# EAGLE design PROG328P (EAGLE 8.0.1)
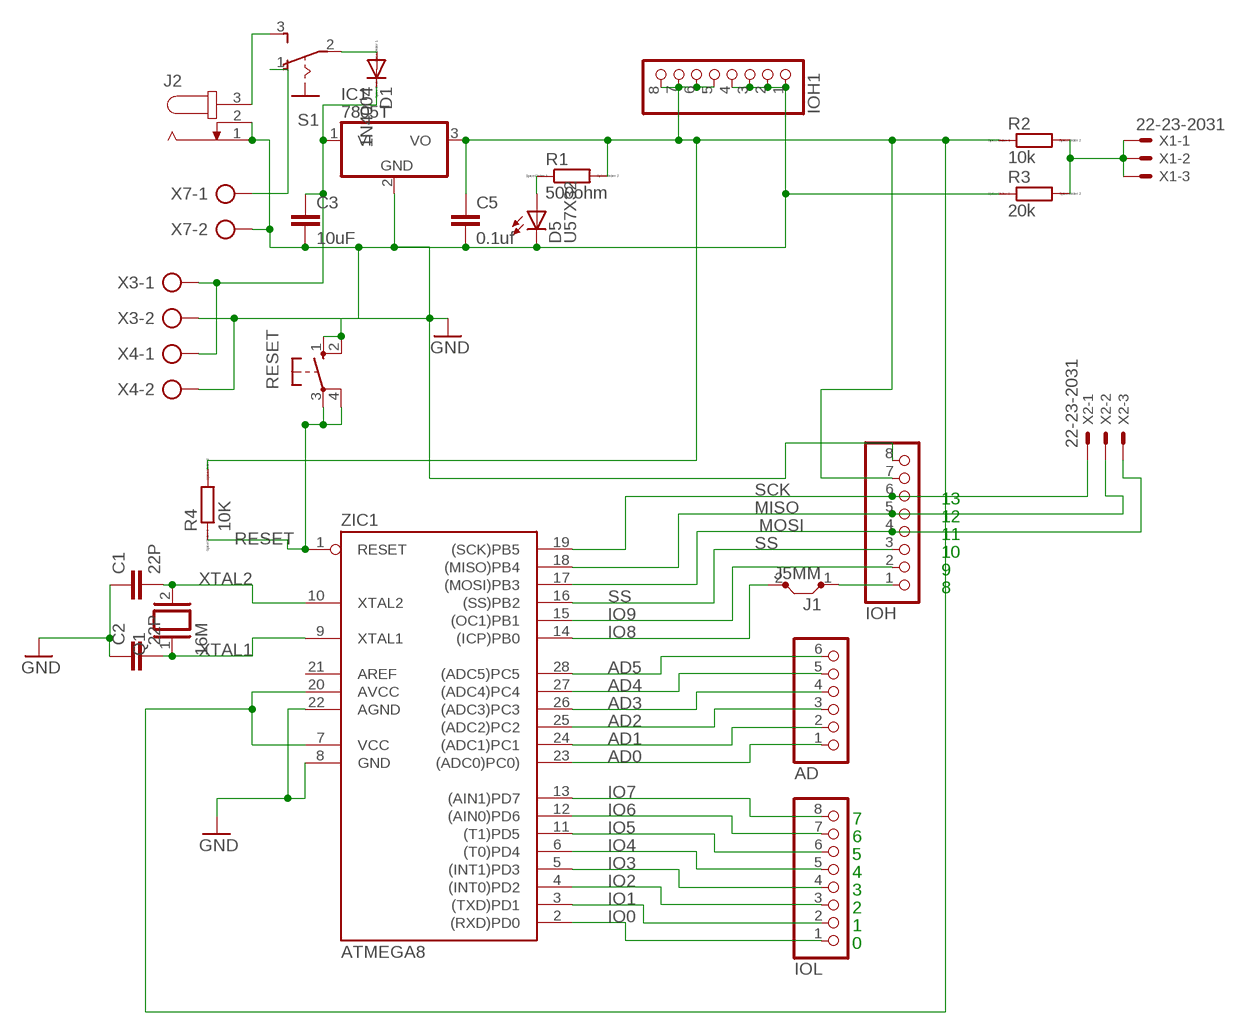
[diagram p0: schematic, sheet 1]

## Parts
AD  PINHD-1X6  [1X06]
C1  22P  C2.5/6  [C2.5-6]
C2  22P  C2.5/6  [C2.5-6]
C3  10uF  C2.5/4  [C2.5-4]
C5  0.1uf  C2.5/4  [C2.5-4]
D1  1N4004  [DO41-10]
D5  U57X32  [U57X32]
IC1  7805T  [TO220H]
IOH  PINHD-1X8  [1X08]
IOH1  PINHD-1X8  [1X08]
IOL  PINHD-1X8  [1X08]
J1  J5MM  [05]
J2  JACK-PLUG0  [SPC4077]
Q1  16M  XTAL/S  [QS]
R1  500ohm  R0207/10  [0207/10]
R2  10k  R0207/10  [0207/10]
R3  20k  R0207/10  [0207/10]
R4  10K  R0207/10  [0207/10]
RESET  10-XX  [B3F-10XX]
S1  255SB  [255SB]
X1  22-23-2031  [22-23-2031]
X2  22-23-2031  [22-23-2031]
X3  AK500/2-H  [AK500/2-H]
X4  AK500/2-H  [AK500/2-H]
X7  AK500/2-H  [AK500/2-H]
ZIC1  ATMEGA8  AT90S4433P  [DIL28-3]

## Nets
AD0: AD.1 ZIC1.23((ADC0)PC0))
AD1: AD.2 ZIC1.24((ADC1)PC1)
AD2: AD.3 ZIC1.25((ADC2)PC2)
AD3: AD.4 ZIC1.26((ADC3)PC3)
AD4: AD.5 ZIC1.27((ADC4)PC4)
AD5: AD.6 ZIC1.28((ADC5)PC5)
GND: C1.1 C2.1 C3.2 C5.2 D5.K(C) IC1.2(GND) IOH1.1 IOH1.2 IOH1.3 IOH1.4 IOH.8 J2.1 J2.2 R3.1 RESET.1(S) RESET.2(S1) X3.2 X4.2 X7.2 ZIC1.8(GND) ZIC1.22(AGND)
IO0: IOL.1 ZIC1.2((RXD)PD0)
IO1: IOL.2 ZIC1.3((TXD)PD1)
IO2: IOL.3 ZIC1.4((INT0)PD2)
IO3: IOL.4 ZIC1.5((INT1)PD3)
IO4: IOL.5 ZIC1.6((T0)PD4)
IO5: IOL.6 ZIC1.11((T1)PD5)
IO6: IOL.7 ZIC1.12((AIN0)PD6)
IO7: IOL.8 ZIC1.13((AIN1)PD7)
IO8: J1.2 ZIC1.14((ICP)PB0)
IO9: IOH.2 ZIC1.15((OC1)PB1)
MISO: IOH.5 X2.2 ZIC1.18((MISO)PB4)
MOSI: IOH.4 X2.3 ZIC1.17((MOSI)PB3)
N$1: IOH.1 J1.1
N$2: D5.A R1.1
N$3: J2.3 S1.3(S)
N$4: S1.1(O) X7.1
N$5: R2.2 R3.2 X1.1 X1.2 X1.3
N$6: D1.A S1.2(P)
N$15: C3.1 D1.C IC1.1(VI) X3.1 X4.1
RESET: R4.1 RESET.3(P) RESET.4(P1) ZIC1.1(RESET)
SCK: IOH.6 X2.1 ZIC1.19((SCK)PB5)
SS: IOH.3 ZIC1.16((SS)PB2)
VCC: C5.1 IC1.3(VO) IOH1.5 IOH1.6 IOH1.7 IOH1.8 IOH.7 R1.2 R2.1 R4.2 ZIC1.7(VCC) ZIC1.20(AVCC)
XTAL1: C2.2 Q1.1 ZIC1.9(XTAL1)
XTAL2: C1.2 Q1.2 ZIC1.10(XTAL2)
Unconnected: ZIC1.21(AREF)

## Notes on the sheet
- 13
- 12
- 11
- 10
- 9
- 8
- 7
- 6
- 5
- 4
- 3
- 2
- 1
- 0

## Library data of the parts
AD = pinhead:PINHD-1X6: PIN HEADER
C1-C3 C5 = capacitor-wima:C: CAPACITOR naming: grid - package width
D1 = diode:1N4004: DIODE general purpose rectifier, 1 A
D5 = led:U57X32: LED rectangle, 5.7 x 3.2 mm
IC1 = linear:78*: Positive VOLTAGE REGULATOR Source: http://cache.national.com/ds/LM/LM78L05.pdf http://www.fairchildsemi.com/ds/LM/LM7805.pdf
IOH IOH1 IOL = pinhead:PINHD-1X8: PIN HEADER
J1 = jumper:J: Bridge
J2 = con-jack:JACK-PLUG: DC POWER JACK Power Jack, DC, Right Angle, Through Hole, Rated 5A at 16VDC, PC Terminals Distributor: Farnell (www.Farnell.de) Drawing: 84N1161.pdf / 84N1162.pdf Manufacturer: SPC Technology (www.spctechnology.com) Type: SPC4077 / SPC 4078; OC_FARNELL: unknown; OC_NEWARK: unknown
Q1 = special:XTAL/S: CRYSTAL
R1-R4 = eagle-ltspice:R: RESISTOR, European symbol; SPICEMODEL: NONE; SPICEPREFIX: R
RESET = switch-omron:10-XX: OMRON SWITCH; MPN: B3F-1000; OC_FARNELL: 176432; OC_NEWARK: 36M3542
S1 = switch:255SB: SLIDING SWITCH Distributor Buerklin, 11G810
X1 X2 = con-molex:22-23-2031: .100" (2.54mm) Center Header - 3 Pin; MF: MOLEX; MPN: 22-23-2031; OC_FARNELL: 1462950; OC_NEWARK: 30C0862
X3 X4 X7 = con-ptr500:AK500/2-H: CONNECTOR Aug. 2004 / PTR Meßtechnik: Die Bezeichnung der Serie AK505 wurde geändert. Es handelt sich hierbei um AK500 in horizontaler Ausführung.; OC_FARNELL: unknown; OC_NEWARK: unknown
ZIC1 = atmel:AT90S4433: MICROCONTROLLER 4 Kbytes FLASH 128 bytes SRAM 256 bytes EEPROM UART 6-channel 10 bit ADC

## Board
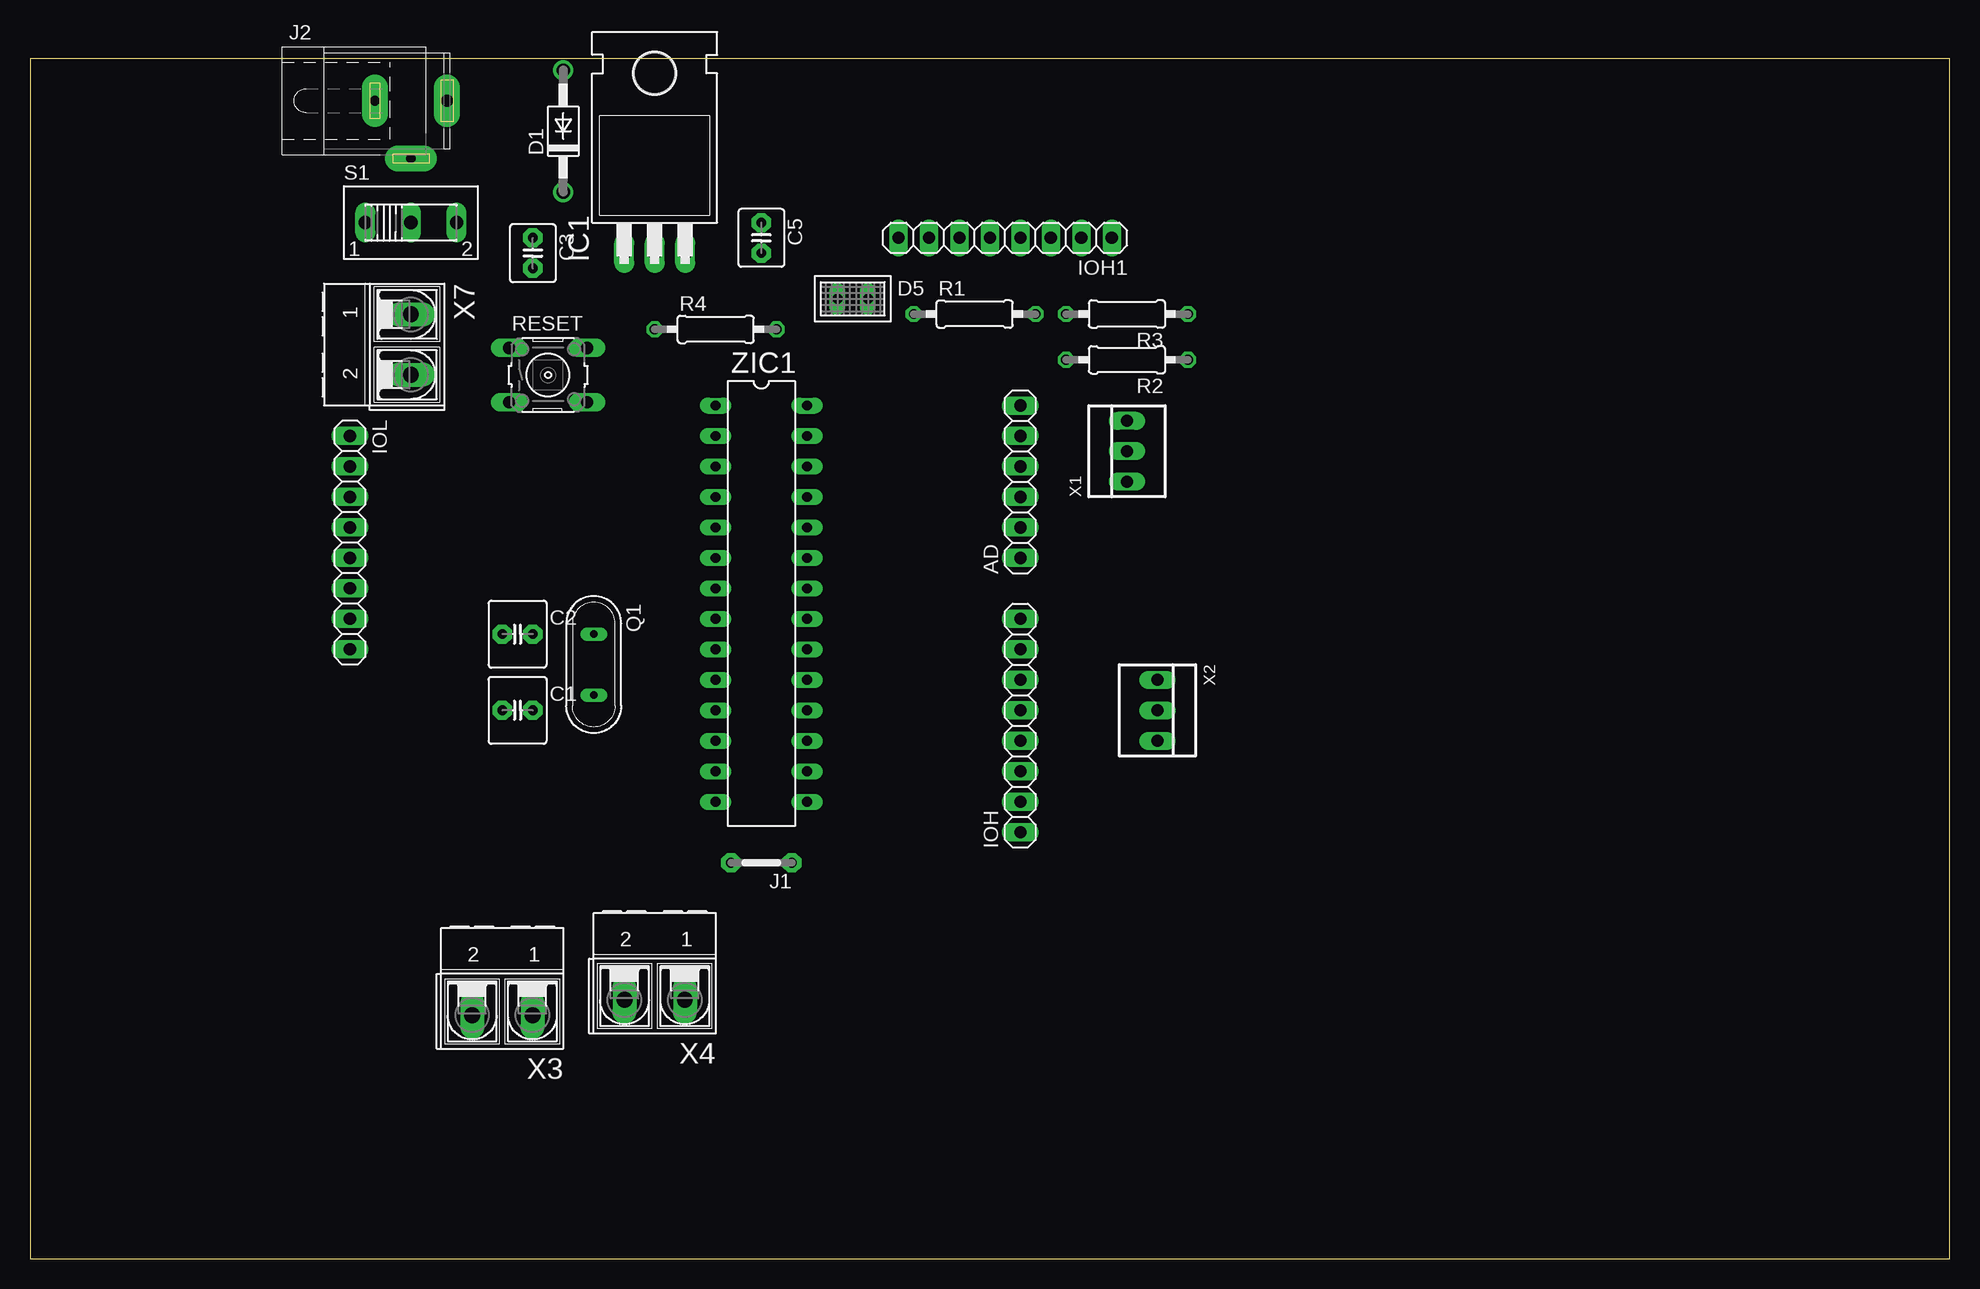
[diagram p1: board, top side]
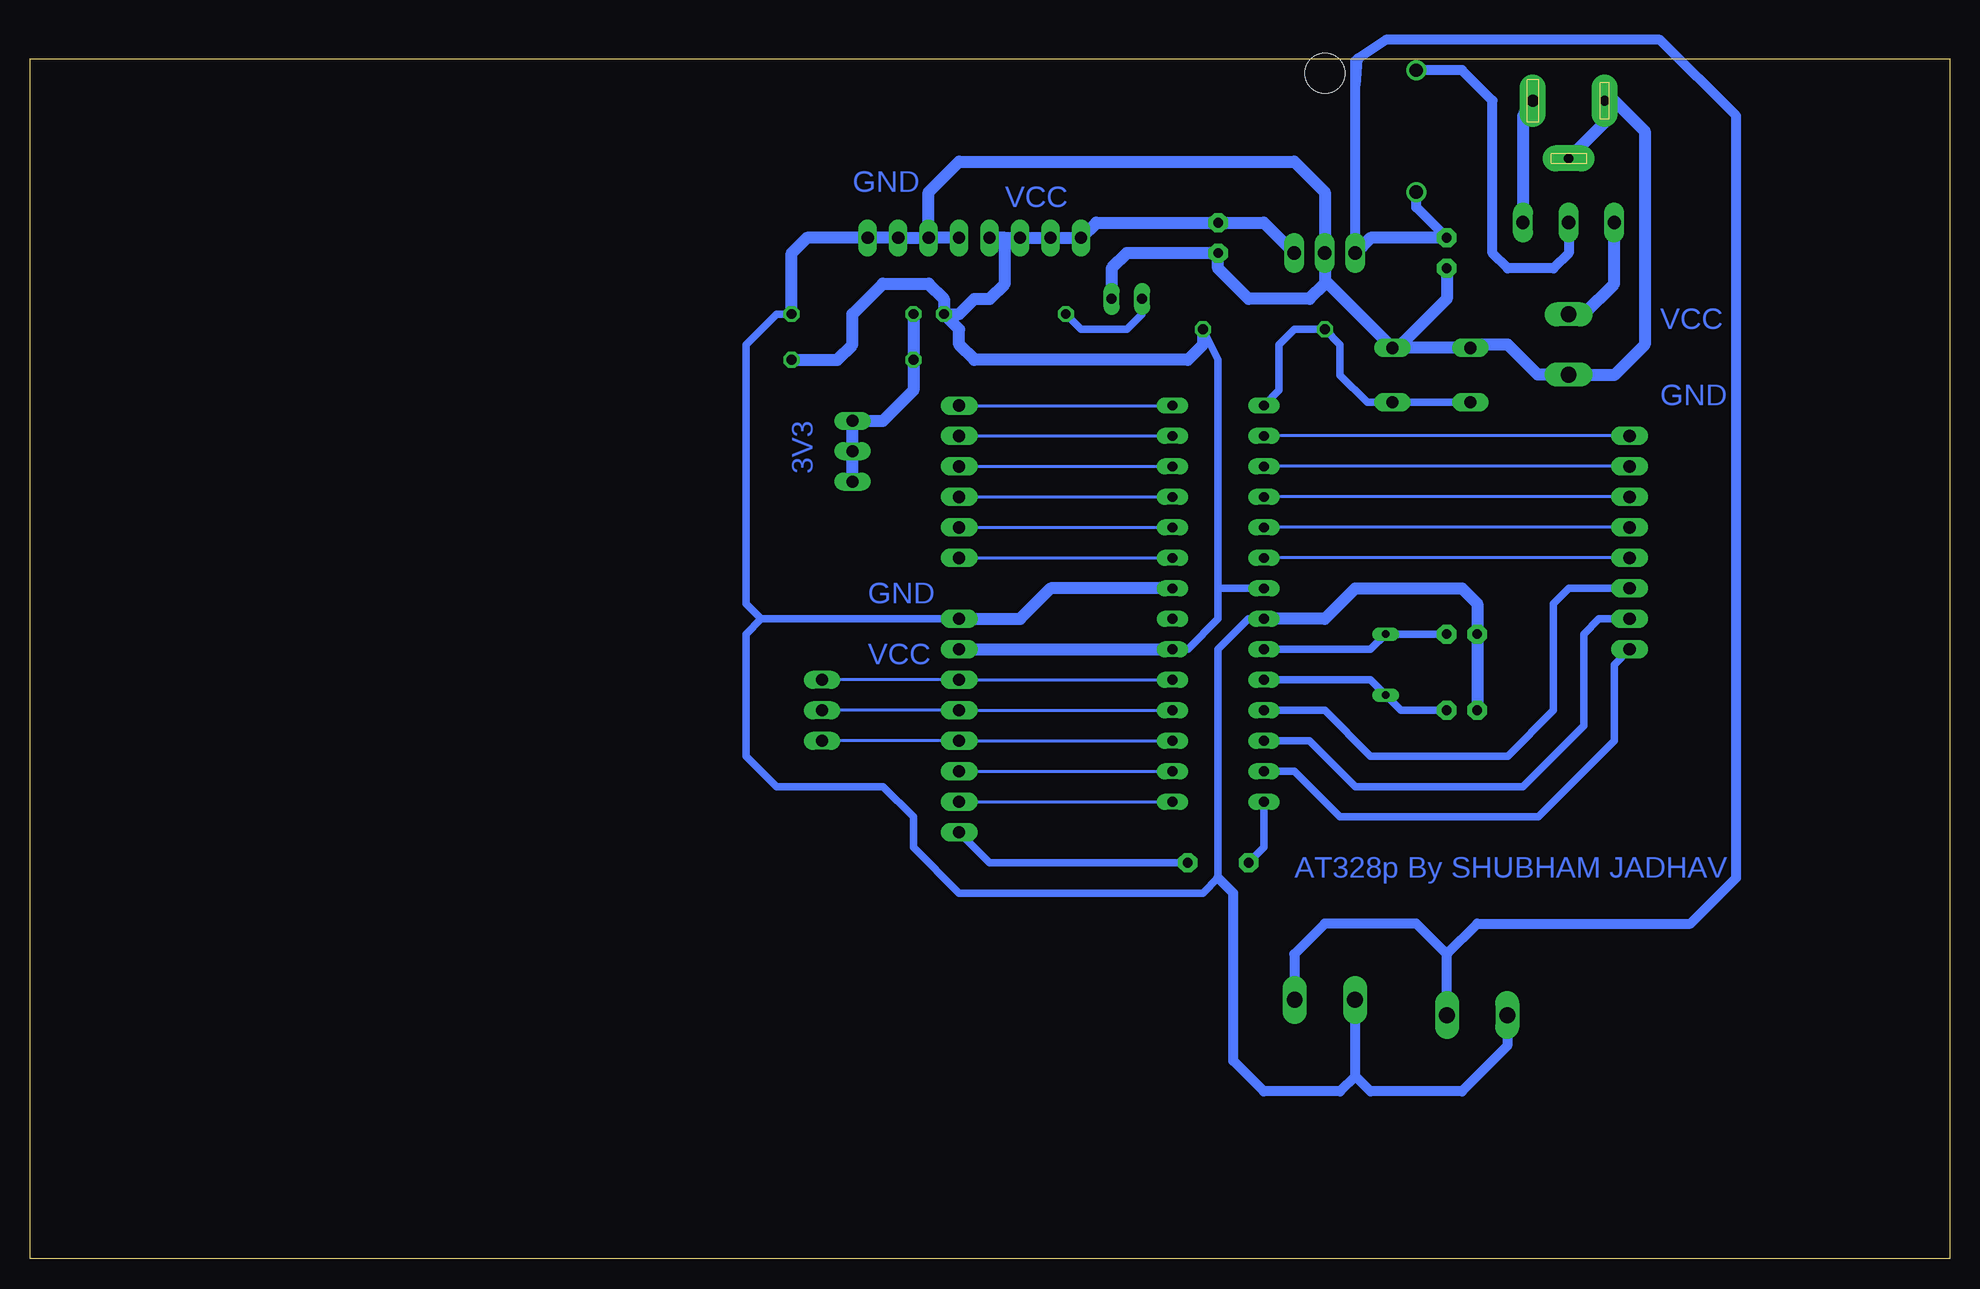
[diagram p2: board, bottom side, seen from below]

Size 160 x 100 mm. Coordinates in mm from the lower left corner, seen from the top.
Outline: 0,0 160,0 160,100 0,100 0,0
Copper layers (1*16): Top 0.035mm / dielectric 1.5mm / Bottom 0.035mm
Design rules "default": minimum track width 10mil, minimum drill 24mil, track to track 8mil, track to pad 8mil, pad to pad 8mil, via to via 8mil, smd to smd 8mil, copper to edge 40mil, drill to drill 8mil, minimum pad ring 10mil, minimum via ring 8mil, stop-mask expansion 4mil, vias tented up to drill 0mil, thermal gap 10mil

### Footprints (pad centres in the part's own frame; a part is rotated, then mirrored left to right if it is on the bottom)
1X06 = drill 1.016 long: 1 -6.35,0; 2 -3.81,0; 3 -1.27,0; 4 1.27,0; 5 3.81,0; 6 6.35,0
C2.5-6 = drill 0.813 pad 1.6 octagon: 1 -1.27,0; 2 1.27,0
C2.5-4 = drill 0.813 pad 1.6 octagon: 1 -1.27,0; 2 1.27,0
DO41-10 = drill 1.118: A 5.08,0; C -5.08,0
U57X32 = drill 0.813 long: A -1.27,0; K 1.27,0
TO220H = drill 1.118 long: 1 -2.54,-10.16; 2 0,-10.16; 3 2.54,-10.16 | hole 3.302: 0,4.826
1X08 = drill 1.016 long: 1 -8.89,0; 2 -6.35,0; 3 -3.81,0; 4 -1.27,0; 5 1.27,0; 6 3.81,0; 7 6.35,0; 8 8.89,0
05 = drill 0.813 pad 1.6 octagon: 1 -2.54,0; 2 2.54,0
SPC4077 = drill 0.8 pad 2.184 long: 1 -3,0; 2 0,-4.8 | drill 1 pad 2.184 long: 3 3,0
QS = drill 0.61 long: 1 -2.54,0; 2 2.54,0
0207/10 = drill 0.813 octagon: 1 -5.08,0; 2 5.08,0
B3F-10XX = drill 1.016 long: 1 -3.251,2.261; 2 3.251,2.261; 3 -3.251,-2.261; 4 3.251,-2.261
255SB = drill 1.118 long: 1 -3.81,0; 2 0,0; 3 3.81,0
22-23-2031 = drill 1 long: 1 -2.54,0; 2 0,0; 3 2.54,0
AK500/2-H = drill 1.321 long: 1 -2.515,0; 2 2.515,0
DIL28-3 = drill 0.813 long: 1 -16.51,-3.81; 2 -13.97,-3.81; 3 -11.43,-3.81; 4 -8.89,-3.81; 5 -6.35,-3.81; 6 -3.81,-3.81; 7 -1.27,-3.81; 8 1.27,-3.81; 9 3.81,-3.81; 10 6.35,-3.81; 11 8.89,-3.81; 12 11.43,-3.81; 13 13.97,-3.81; 14 16.51,-3.81; 15 16.51,3.81; 16 13.97,3.81; 17 11.43,3.81; 18 8.89,3.81; 19 6.35,3.81; 20 3.81,3.81; 21 1.27,3.81; 22 -1.27,3.81; 23 -3.81,3.81; 24 -6.35,3.81; 25 -8.89,3.81; 26 -11.43,3.81; 27 -13.97,3.81; 28 -16.51,3.81

### Placement (x,y rotation side)
AD  82.55,64.77 90 top
C1  40.64,45.72 0 top
C2  40.64,52.07 0 top
C3  41.91,83.82 270 top
C5  60.96,85.09 270 top
D1  44.45,93.98 90 top
D5  68.58,80.01 0 top
IC1  52.07,93.98 0 top
IOH  82.55,44.45 90 top
IOH1  81.28,85.09 180 top
IOL  26.67,59.69 270 top
J1  60.96,33.02 180 top
J2  31.75,96.52 0 top
Q1  46.99,49.53 270 top
R1  78.74,78.74 0 top
R2  91.44,74.93 180 top
R3  91.44,78.74 180 top
R4  57.15,77.47 0 top
RESET  43.18,73.66 0 top
S1  31.75,86.36 0 top
X1  91.44,67.31 90 top
X2  93.98,45.72 270 top
X3  39.37,20.32 180 top
X4  52.07,21.59 180 top
X7  31.75,76.2 270 top
ZIC1  60.96,54.61 270 top

### Tracks (layer width: path | path; a pad name or v marks a point on that pad's centre or on a via)
AD0
  Bottom 0.254: AD.1 ZIC1.23
AD1
  Bottom 0.254: AD.2 ZIC1.24
AD2
  Bottom 0.254: AD.3 ZIC1.25
AD3
  Bottom 0.254: AD.4 ZIC1.26
AD4
  Bottom 0.254: AD.5 ZIC1.27
AD5
  Bottom 0.254: AD.6 ZIC1.28
GND
  Bottom 0.61: ZIC1.8 58.42,53.34 60.96,50.8 60.96,31.75 62.23,30.48 82.55,30.48 86.36,34.29 86.36,36.83 88.9,39.37 97.79,39.37 100.33,41.91 100.33,52.07 99.06,53.34 | 99.06,53.34 IOH.8 | 99.06,53.34 100.33,54.61 100.33,76.2 97.79,78.74 R3.1
  Bottom 0.813: X3.2 36.85,17.75 40.64,13.97 48.26,13.97 49.53,15.24 | 49.53,15.24 49.53,21.57 X4.2 | 49.53,15.24 50.8,13.97 57.15,13.97 59.69,16.51 59.69,30.48 60.96,31.75
  Bottom 1.016: J2.2 28.75,94.72 J2.1 27.94,96.52 25.4,93.98 25.4,76.2 27.94,73.66 31.73,73.66 X7.2 34.31,73.69 36.83,76.2 39.65,76.2 RESET.1 RESET.2 | C3.2 41.91,80.01 45.72,76.2 46.15,76.2 RESET.2 | 52.07,81.28 IC1.2 52.07,88.9 54.61,91.44 82.55,91.44 85.09,88.9 IOH1.3 | 52.07,81.28 51.79,81.28 RESET.2 | D5.K 69.85,82.55 68.58,83.82 C5.2 60.96,82.55 58.42,80.01 53.34,80.01 52.07,81.28 | IOH1.3 IOH1.2 IOH1.1 95.25,85.09 96.52,83.82 R3.1 | IOH1.4 IOH1.3 | ZIC1.22 74.93,55.88 77.47,53.34 IOH.8 | ZIC1.8 52.07,53.34 49.53,55.88 40.64,55.88 39.37,54.61 C2.1 C1.1
IO0
  Bottom 0.254: IOL.1 ZIC1.2
IO1
  Bottom 0.254: IOL.2 ZIC1.3
IO2
  Bottom 0.254: IOL.3 ZIC1.4
IO3
  Bottom 0.254: IOL.4 ZIC1.5
IO4
  Bottom 0.254: IOL.5 ZIC1.6
IO5
  Bottom 0.61: IOL.6 31.75,55.88 33.02,54.61 33.02,45.72 36.83,41.91 48.26,41.91 52.07,45.72 ZIC1.11
IO6
  Bottom 0.61: ZIC1.12 53.34,43.18 49.53,39.37 35.56,39.37 30.48,44.45 30.48,52.07 29.21,53.34 IOL.7
IO7
  Bottom 0.61: IOL.8 27.94,49.53 27.94,43.18 34.29,36.83 50.8,36.83 54.61,40.64 ZIC1.13
IO8
  Bottom 0.61: J1.2 57.15,34.29 ZIC1.14
IO9
  Bottom 0.254: IOH.2 ZIC1.15
MISO
  Bottom 0.254: ZIC1.18 IOH.5 X2.2
MOSI
  Bottom 0.254: ZIC1.17 IOH.4 X2.3
N$1
  Bottom 0.61: J1.1 80.01,33.02 IOH.1
N$2
  Bottom 0.61: D5.A 67.31,78.74 68.58,77.47 72.39,77.47 R1.1
N$3
  Bottom 1.016: J2.3 34.75,96.06 35.56,95.25 S1.3
N$4
  Bottom 1.016: X7.1 30.5,78.72 27.94,81.28 S1.1
N$5
  Bottom 1.016: R3.2 R2.2 86.36,72.39 88.9,69.85 X1.3 X1.2 X1.1
N$6
  Bottom 0.813: S1.2 31.75,83.82 33.02,82.55 36.83,82.55 38.1,83.82 38.1,96.52 40.64,99.06 D1.A
N$15
  Bottom 0.813: D1.C 44.45,87.63 C3.1 | X3.1 41.88,25.38 | 41.88,25.38 44.45,27.94 52.07,27.94 54.61,25.4 54.61,21.61 X4.1 | 41.88,25.38 41.88,25.43 39.37,27.94 21.59,27.94 17.78,31.75 17.78,95.25 24.13,101.6 46.99,101.6 49.34,100.04 | 49.34,100.04 49.53,97.79 | IC1.1 49.53,97.79 | 49.53,97.79 49.53,99.84 49.34,100.04
  Bottom 1.016: C3.1 48.26,85.09 IC1.1
RESET
  Bottom 0.61: RESET.3 RESET.4 48.54,71.4 50.8,73.66 50.8,76.2 R4.1 54.61,77.47 55.88,76.2 55.88,72.39 ZIC1.1
SCK
  Bottom 0.254: ZIC1.19 IOH.6 X2.1
SS
  Bottom 0.254: IOH.3 ZIC1.16
VCC
  Bottom 0.61: ZIC1.7 60.96,55.88 | ZIC1.20 63.5,50.8 60.96,53.34 60.96,55.88 | 60.96,55.88 60.96,74.93 R4.2
  Bottom 1.016: IC1.3 57.15,86.36 C5.1 71.12,86.36 IOH1.8 IOH1.7 IOH1.6 78.74,85.09 | R4.2 62.23,76.2 63.5,74.93 81.28,74.93 82.55,76.2 82.55,77.47 R1.2 | 78.74,85.09 IOH1.5 | R1.2 82.55,78.74 81.28,80.01 80.01,80.01 78.74,81.28 78.74,85.09 | R2.1 92.71,74.93 91.44,76.2 91.44,78.74 88.9,81.28 85.09,81.28 83.82,80.01 R1.2 | IOH.7 ZIC1.20
XTAL1
  Bottom 0.61: ZIC1.9 48.26,50.8 Q1.1 C2.2
XTAL2
  Bottom 0.61: C1.2 45.72,45.72 Q1.2 48.26,48.26 ZIC1.10

### Text on the board
Bottom: GND | VCC | VCC | GND | 3V3 | GND | VCC | AT328p By SHUBHAM JADHAV